# Altium schematic sheet Power.SchDoc: HB+SPO2 READER | POWER
size A4; DocumentNumber: 1; Revision: 1; SheetNumber: 2; SheetTotal: 4
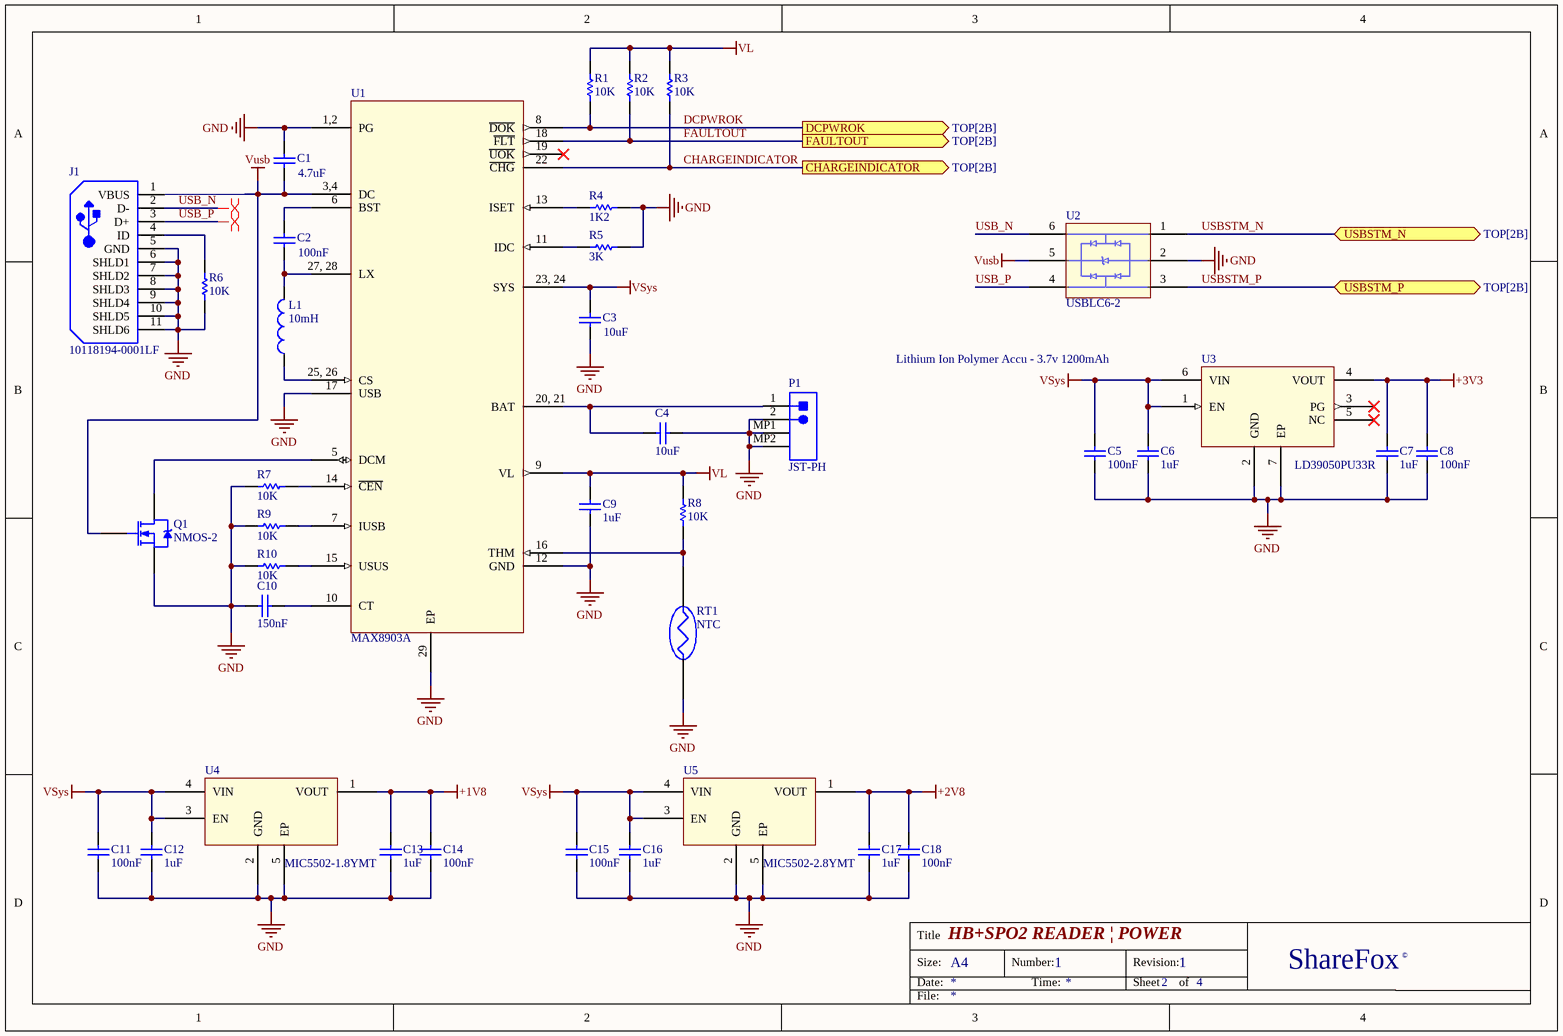
[diagram p0: Power.SchDoc]

## Parts
C1  value 4.7uF  [C_0603]  (hidden comment: Cap)
C2  value 100nF  [C_0603]  (hidden comment: Cap)
C3  value 10uF  [C_0603]  (hidden comment: Cap)
C4  value 10uF  [C_0603]  (hidden comment: Cap)
C5  value 100nF  [C_0603]  (hidden comment: Cap)
C6  value 1uF  [C_0603]  (hidden comment: Cap)
C7  value 1uF  [C_0603]  (hidden comment: Cap)
C8  value 100nF  [C_0603]  (hidden comment: Cap)
C9  value 1uF  [C_0603]  (hidden comment: Cap)
C10  value 150nF  [C_0603]  (hidden comment: Cap)
C11  value 100nF  [C_0603]  (hidden comment: Cap)
C12  value 1uF  [C_0603]  (hidden comment: Cap)
C13  value 1uF  [C_0603]  (hidden comment: Cap)
C14  value 100nF  [C_0603]  (hidden comment: Cap)
C15  value 100nF  [C_0603]  (hidden comment: Cap)
C16  value 1uF  [C_0603]  (hidden comment: Cap)
C17  value 1uF  [C_0603]  (hidden comment: Cap)
C18  value 100nF  [C_0603]  (hidden comment: Cap)
J1  10118194-0001LF  [FCI-10118194-0001LF-5_V]
L1  value 10mH  [L-0603]  (hidden comment: Inductor)
P1  JST-PH  [JST- S2B-PH-SM4-TB(LF)(SN)-2_V]
Q1  NMOS-2  [TO-220AB]
R1  value 10K  [C_0603]  (hidden comment: Res1)
R2  value 10K  [C_0603]  (hidden comment: Res1)
R3  value 10K  [C_0603]  (hidden comment: Res1)
R4  value 1K2  [C_0603]  (hidden comment: Res1)
R5  value 3K  [C_0603]  (hidden comment: Res1)
R6  value 10K  [C_0603]  (hidden comment: Res1)
R7  value 10K  [C_0603]  (hidden comment: Res1)
R8  value 10K  [C_0603]  (hidden comment: Res1)
R9  value 10K  [C_0603]  (hidden comment: Res1)
R10  value 10K  [C_0603]  (hidden comment: Res1)
RT1  NTC
U1  MAX8903A  [QFN28P40S400X400EP260x260]
U2  USBLC6-2  [SOT23-6P95R280X90]
U3  LD39050PU33R  [SON6P95S300X300EP237x149]
U4  MIC5502-1.8YMT  [DFN4P65S100x100EP48x48]
U5  MIC5502-2.8YMT  [DFN4P65S100x100EP48x48]

## Ports
CHARGEINDICATOR (out, see TOP[2B]), DCPWROK (out, see TOP[2B]), FAULTOUT (out, see TOP[2B]), USBSTM_N (bidir, see TOP[2B]), USBSTM_P (bidir, see TOP[2B])

## Nets
+1V8: C13.1 C14.1 U4.1(VOUT)
+2V8: C17.1 C18.1 U5.1(VOUT)
+3V3: C7.1 C8.1 U3.4(VOUT)
GND: C1.2 C3.1 C4.1 C5.2 C6.2 C7.2 C8.2 C9.2 C10.1 C11.2 C12.2 C13.2 C14.2 C15.2 C16.2 C17.2 C18.2 J1.5(GND) J1.6(SHLD1) J1.7(SHLD2) J1.8(SHLD3) J1.9(SHLD4) J1.10(SHLD5) J1.11(SHLD6) P1.2 P1.MP1 P1.MP2 Q1.3(S) R4.1 R5.1 R6.2 R7.2 R9.2 R10.2 RT1.1 U1.1,2(PG) U1.12(GND) U1.17(USB) U1.29(EP) U2.2 U3.2(GND) U3.7(EP) U4.2(GND) U4.5(EP) U5.2(GND) U5.5(EP)
VL: C9.1 R1.2 R2.2 R3.2 R8.1 U1.9(VL)
VSys: C3.2 C5.1 C6.1 C11.1 C12.1 C15.1 C16.1 U1.23,_24(SYS) U3.1(EN) U3.6(VIN) U4.3(EN) U4.4(VIN) U5.3(EN) U5.4(VIN)
Vusb: C1.1 J1.1(VBUS) Q1.1(G) U1.3,4(DC) U2.5
CHARGEINDICATOR: R3.1 U1.22(~{CHG}) ; port CHARGEINDICATOR
DCPWROK: R1.1 U1.8(~{DOK}) ; port DCPWROK
FAULTOUT: R2.1 U1.18(~{FLT}) ; port FAULTOUT
USB_N: J1.2(D-) U2.6
USB_P: J1.3(D+) U2.4
USBSTM_N: U2.1 ; port USBSTM_N
USBSTM_P: U2.3 ; port USBSTM_P
NetC2_1: C2.1 L1.2 U1.27,_28(LX)
NetC2_2: C2.2 U1.6(BST)
NetC4_2: C4.2 P1.1 U1.20,_21(BAT)
NetC10_2: C10.2 U1.10(CT)
NetJ1_4: J1.4(ID) R6.1
NetL1_1: L1.1 U1.25,_26(CS)
NetQ1_2: Q1.2(D) U1.5(DCM)
NetR4_2: R4.2 U1.13(ISET)
NetR5_2: R5.2 U1.11(IDC)
NetR7_1: R7.1 U1.14(~{CEN})
NetR8_2: R8.2 RT1.2 U1.16(THM)
NetR9_1: R9.1 U1.7(IUSB)
NetR10_1: R10.1 U1.15(USUS)

Not connected (* = marked no-connect by the designer): U1 19(~{UOK})*; U3 3(PG)* 5(NC)*

## Layout directives
differential pair: USB_N, USB_P

## Notes on the sheet
- (near P1) Lithium Ion Polymer Accu - 3.7v 1200mAh
- Title
- Size:
- Date:
- A4
- Number:
- Time:
- Revision:
- Sheet
- of
- ShareFox
- ©
- File:

## Library data of the parts
C1-C18 = Cap: Capacitor; Published: 8-Jun-2000; LatestRevisionDate: 17-Jul-2002; LatestRevisionNote: Re-released for DXP Platform.; PackageReference: RAD-0.3; Publisher: Altium Limited; PackageDescription: Radial Cap, Thru-Hole; 2 Leads; 0.3 in Pin Spacing
J1 = CMP-2000-05120-1: Micro USB B Type Receptacle, 1.8 A, -55 to 85 degC, 5-Pin SMD, RoHS, Tape and Reel; Manufacturer: Amphenol FCI; Body Orientation: RightAngle; Number of Contacts: 5; Pitch: 0.65mm; Gender: RCP; Rad Hard: No; Package Reference: 10118194-0001LF-5; Mounting: SurfaceMount; Manufacturer URL: http://www.fci.com/; Packaging: CutTape; Datasheet URL: https://datasheet.ciiva.com/26945/getdatasheetpartid-418619-26945695.pdf; Termination Method: Solder; Package Description: 5-Pin Surface Mount Device, Body 8.05 x 5.53 mm, Pitch 0.65 mm; Type: MicroUSBTypeB; Datasheet Version: Rev. A, 10/2011
L1 = Inductor: Code_IEC: 1005; Published: 8-Jun-2000; LatestRevisionDate: 29-May-2009; LatestRevisionNote: IPC-7351 Footprint Added.; PackageReference: 0402-A; Publisher: Altium Limited; PackageDescription: Chip Inductor; Code_JEITA: 0402
P1 = CMP-1755-00001-1: Male Header, Pitch 2 mm, 1 x 2 Position, Height 5.5 mm, -25 to 85 degC, RoHS, Tape and Reel; Current Rating: 3 A; ComponentLink1URL: http://www.jst.com/home2.html; Radiation Hardening: No; RoHSCompliant: True; Mount: Through Hole; Contact Material: Bronze; Package Quantity: 100; Width: 2.34 mm; DatasheetVersion: Dec-12; Height: 8.13 mm; Max Operating Temperature: 105degC; ComponentLink2Description: Datasheet; Lead Pitch: 0.1 inch; Contact Finish: Lead; Packaging: Bulk; Colour: Black; Contact Plating: Tin; Min Operating Temperature: -65degC; ComponentLink1Description: Manufacturer URL; PackageReference: S2B-PH-SM4-TB(LF)(SN)-2; PackageDescription: Male Header, Pitch 2 mm, 1 x 2 Position, Height 5.5 mm; ComponentLink2URL: http://www.jst-mfg.com/product/pdf/eng/ePH.pdf; Pins: 40; Length: 101.19 mm
Q1 = NMOS-2: N-Channel Power MOSFET; Note: Pin 2 is electrically connected to pin 4.; Published: 8-Jun-2000; LatestRevisionDate: 17-Jul-2002; LatestRevisionNote: Re-released for DXP Platform.; DatasheetVersion: PD-9.814; PackageVersion: Feb-1997; PackageReference: TO-220AB; Publisher: Altium Limited; PackageDescription: TO, Thru-Hole, Vertical, Heatsink Mounted; 3 In-Line Leads; Pitch 2.54 mm; ComponentLink1Description: Manufacturer Link; ComponentLink1URL: http://www.irf.com/
R1-R10 = Res1: Resistor; Published: 8-Jun-2000; LatestRevisionDate: 17-Jul-2002; LatestRevisionNote: Re-released for DXP Platform.; PackageReference: AXIAL-0.3; Publisher: Altium Limited; PackageDescription: Axial Device, Thru-Hole; 2 Leads; 0.3 in Pin Spacing
RT1 = NTC/PTC: 2322-640-63103
U1 = MAX8903A: 2A 1-Cell Li+ DC-DC Chargersfor USB and Adapter Power
U2 = USBLC6-2: Very low capacitance ESD protection
U3 = LD39050PUxxR: 500 mA low quiescent current and low noise voltage regulator
U4 U5 = MIC550x-x.xYMT: Single 300mA LDO